# Altium schematic sheet Ethernet & LCD.SchDoc
size A4
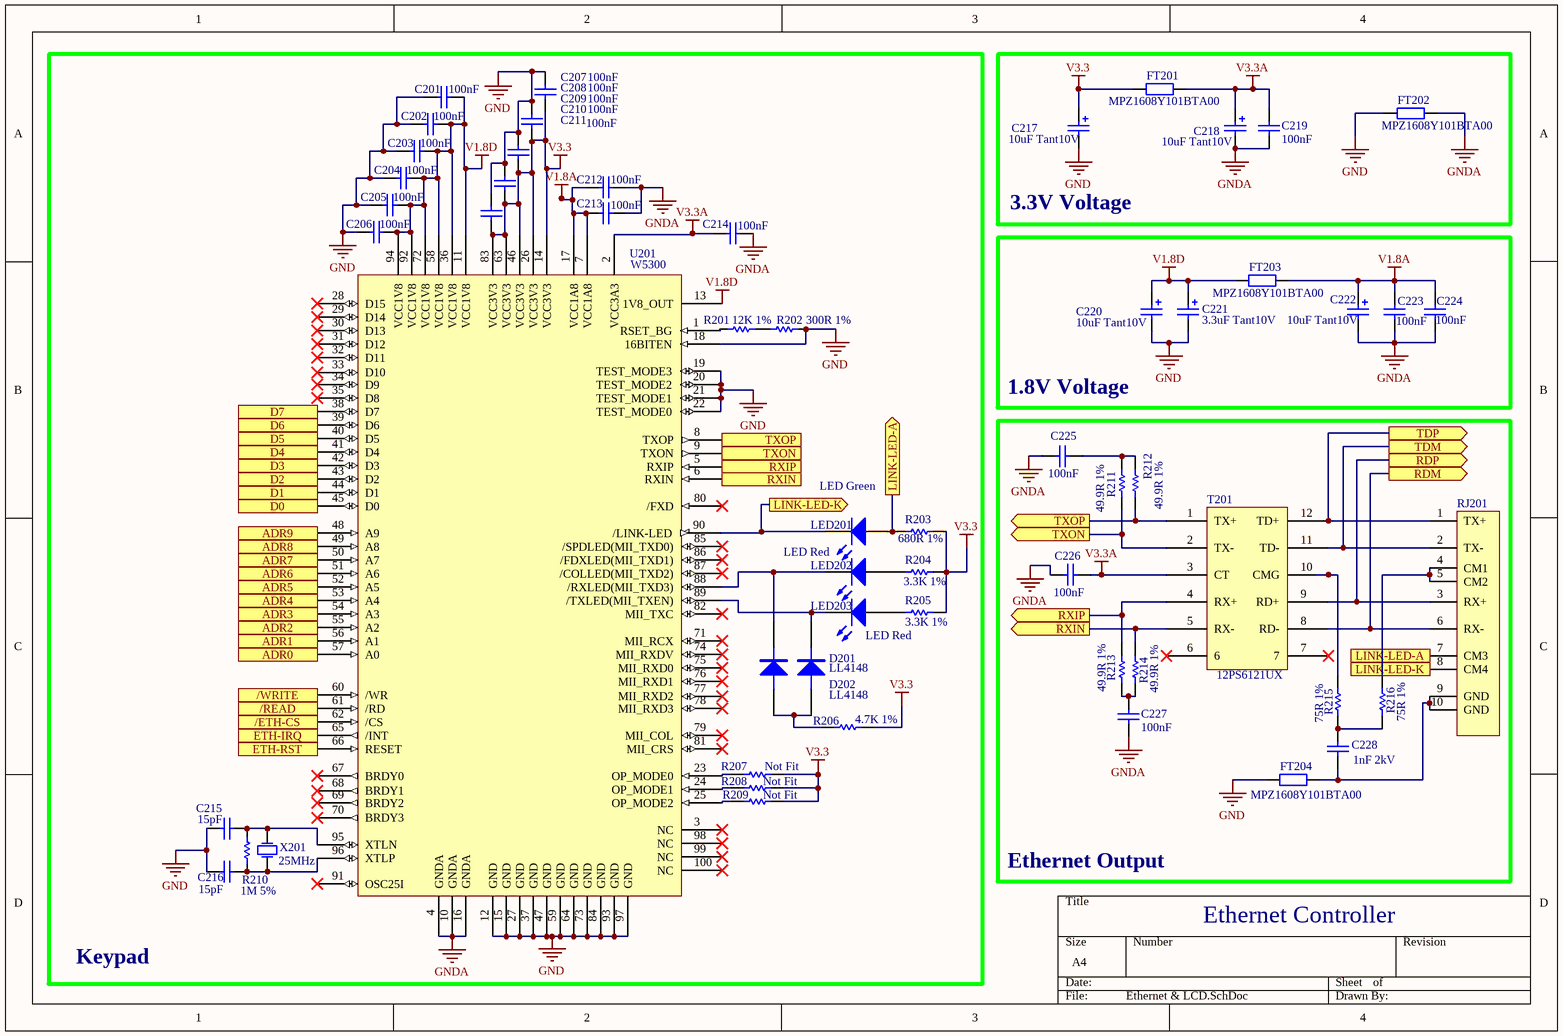
[diagram p0: Ethernet & LCD.SchDoc]

## Parts
C201  100nF  [1206_FA]
C202  100nF  [1206_FA]
C203  100nF  [1206_FA]
C204  100nF  [1206_FA]
C205  100nF  [1206_FA]
C206  100nF  [1206_FA]
C207  100nF  [1206_FA]
C208  100nF  [1206_FA]
C209  100nF  [1206_FA]
C210  100nF  [1206_FA]
C211  100nF  [1206_FA]
C212  100nF  [1206_FA]
C213  100nF  [1206_FA]
C214  100nF  [1206_FA]
C215  15pF  [1206_FA]
C216  15pF  [1206_FA]
C217  10uF Tant10V  [A]
C218  10uF Tant10V  [A]
C219  100nF  [1206_FA]
C220  10uF Tant10V  [A]
C221  3.3uF Tant10V  [A]
C222  10uF Tant10V  [A]
C223  100nF  [1206_FA]
C224  100nF  [1206_FA]
C225  100nF  [1206_FA]
C226  100nF  [1206_FA]
C227  100nF  [1206_FA]
C228  1nF 2kV  [1206_FA]
D201  LL4148  [MiniMelf]
D202  LL4148  [MiniMelf]
FT201  MPZ1608Y101BTA00  [0603]
FT202  MPZ1608Y101BTA00  [0603]
FT203  MPZ1608Y101BTA00  [0603]
FT204  MPZ1608Y101BTA00  [0603]
LED201  LED Green  [LEDSMD_1206]
LED202  LED Red  [LEDSMD_1206]
LED203  LED Red  [LEDSMD_1206]
R201  12K 1%  [1206_FA]
R202  300R 1%  [1206_FA]
R203  680R 1%  [1206_FA]
R204  3.3K 1%  [1206_FA]
R205  3.3K 1%  [1206_FA]
R206  4.7K 1%  [1206_FA]
R207  Not Fit  [1206_FA]
R208  Not Fit  [1206_FA]
R209  Not Fit  [1206_FA]
R210  1M 5%  [1206_FA]
R211  49.9R 1%  [1206_FA]
R212  49.9R 1%  [1206_FA]
R213  49.9R 1%  [1206_FA]
R214  49.9R 1%  [1206_FA]
R215  75R 1%  [1206_FA]
R216  75R 1%  [1206_FA]
RJ201  (no value)  [RJ45b]
T201  12PS6121UX  [12PS6121UX-DATA]
U201  W5300  [100T1_N]
X201  25MHz  [CRYSTAL 25.000MHZ]

## Blocks framed on the sheet
Keypad: C201-C216 D201 D202 LED201-LED203 R201-R210 U201 X201
3.3V Voltage: C217-C219 FT201 FT202
1.8V Voltage: C220-C224 FT203
Ethernet Output: C225-C228 FT204 R211-R216 RJ201 T201

## Ports
/ETH-CS (out), /READ (out), /WRITE (out), ADR0 (out), ADR1 (out), ADR2 (out), ADR3 (out), ADR4 (out), ADR5 (out), ADR6 (out), ADR7 (out), ADR8 (out), ADR9 (out), D0 (out), D1 (out), D2 (out), D3 (out), D4 (out), D5 (out), D6 (out), D7 (out), ETH-IRQ (out), ETH-RST (out), LINK-LED-A (out), LINK-LED-K (out), RDM (out), RDP (out), RXIN (out), RXIP (out), TDM (out), TDP (out), TXON (out), TXOP (out)

## Nets
GND: C201.2 C202.2 C203.2 C204.2 C205.2 C206.2 C207.1 C208.1 C209.1 C210.1 C211.1 C215.2 C216.2 C217.2 C220.2 C221.2 FT202.1 FT204.1 R202.2 U201.12(GND) U201.15(GND) U201.18(16BITEN) U201.19(TEST_MODE3) U201.20(TEST_MODE2) U201.21(TEST_MODE1) U201.22(TEST_MODE0) U201.27(GND) U201.37(GND) U201.47(GND) U201.59(GND) U201.64(GND) U201.73(GND) U201.84(GND) U201.93(GND) U201.97(GND)
GNDA: C212.1 C213.1 C214.1 C218.2 C219.1 C222.2 C223.1 C224.1 C225.1 C226.1 C227.1 FT202.2 U201.4(GNDA) U201.10(GNDA) U201.16(GNDA)
V1.8A: C212.2 C213.2 C222.1 C223.2 C224.2 FT203.2 U201.7(VCC1A8) U201.17(VCC1A8)
V1.8D: C201.1 C202.1 C203.1 C204.1 C205.1 C206.1 C220.1 C221.1 FT203.1 U201.11(VCC1V8) U201.13(1V8_OUT) U201.36(VCC1V8) U201.58(VCC1V8) U201.72(VCC1V8) U201.92(VCC1V8) U201.94(VCC1V8)
V3.3: C207.2 C208.2 C209.2 C210.2 C211.2 C217.1 FT201.1 R203.2 R204.2 R205.2 R206.2 R207.2 R208.2 R209.2 U201.14(VCC3V3) U201.26(VCC3V3) U201.46(VCC3V3) U201.63(VCC3V3) U201.83(VCC3V3)
V3.3A: C214.2 C218.1 C219.2 C226.2 FT201.2 T201.3(CT) U201.2(VCC3A3)
/ETH-CS: U201.62(/CS) ; port /ETH-CS
/READ: U201.61(/RD) ; port /READ
/WRITE: U201.60(/WR) ; port /WRITE
ADR0: U201.57(A0) ; port ADR0
ADR1: U201.56(A1) ; port ADR1
ADR2: U201.55(A2) ; port ADR2
ADR3: U201.54(A3) ; port ADR3
ADR4: U201.53(A4) ; port ADR4
ADR5: U201.52(A5) ; port ADR5
ADR6: U201.51(A6) ; port ADR6
ADR7: U201.50(A7) ; port ADR7
ADR8: U201.49(A8) ; port ADR8
ADR9: U201.48(A9) ; port ADR9
D0: U201.45(D0) ; port D0
D1: U201.44(D1) ; port D1
D2: U201.43(D2) ; port D2
D3: U201.42(D3) ; port D3
D4: U201.41(D4) ; port D4
D5: U201.40(D5) ; port D5
D6: U201.39(D6) ; port D6
D7: U201.38(D7) ; port D7
ETH-IRQ: U201.65(/INT) ; port ETH-IRQ
ETH-RST: U201.66(RESET) ; port ETH-RST
LINK-LED-A: LED201.1(A) R203.1 RJ201.7(CM3) ; port LINK-LED-A
LINK-LED-K: LED201.2(K) RJ201.8(CM4) U201.90(/LINK-LED) ; port LINK-LED-K
RDM: RJ201.6(RX-) T201.8(RD-) ; port RDM
RDP: RJ201.3(RX+) T201.9(RD+) ; port RDP
RXIN: R214.2 T201.5(RX-) U201.6(RXIN) ; port RXIN
RXIP: R213.2 T201.4(RX+) U201.5(RXIP) ; port RXIP
TDM: RJ201.2(TX-) T201.11(TD-) ; port TDM
TDP: RJ201.1(TX+) T201.12(TD+) ; port TDP
TXON: R211.1 T201.2(TX-) U201.9(TXON) ; port TXON
TXOP: R212.1 T201.1(TX+) U201.8(TXOP) ; port TXOP
NetC215_1: C215.1 R210.1 U201.95(XTLN) X201.1(OSC1)
NetC216_1: C216.1 R210.2 U201.96(XTLP) X201.2(OSC2)
NetC225_2: C225.2 R211.2 R212.2
NetC227_2: C227.2 R213.1 R214.1
NetC228_1: C228.1 FT204.2 RJ201.9(GND) RJ201.10(GND)
NetC228_2: C228.2 R215.1 R216.1
NetD201_1: D201.1(A) D202.1(A) R206.1
NetD201_2: D201.2(K) LED203.2(K) U201.89(/TXLED(MII_TXEN))
NetD202_2: D202.2(K) LED202.2(K) U201.88(/RXLED(MII_TXD3))
NetLED202_1: LED202.1(A) R204.1
NetLED203_1: LED203.1(A) R205.1
NetR201_1: R201.1 U201.1(RSET_BG)
NetR201_2: R201.2 R202.1
NetR207_1: R207.1 U201.23(OP_MODE0)
NetR208_1: R208.1 U201.24(OP_MODE1)
NetR209_1: R209.1 U201.25(OP_MODE2)
NetR215_2: R215.2 T201.10(CMG)
NetR216_2: R216.2 RJ201.4(CM1) RJ201.5(CM2)

Not connected (* = marked no-connect by the designer): T201 6* 7*; U201 3(NC)* 28(D15)* 29(D14)* 30(D13)* 31(D12)* 32(D11)* 33(D10)* 34(D9)* 35(D8)* 67(BRDY0)* 68(BRDY1)* 69(BRDY2)* 70(BRDY3)* 71(MII_RCX)* 74(MII_RXDV)* 75(MII_RXD0)* 76(MII_RXD1)* 77(MII_RXD2)* 78(MII_RXD3)* 79(MII_COL)* 80(/FXD)* 81(MII_CRS)* 82(MII_TXC)* 85(/SPDLED(MII_TXD0))* 86(/FDXLED(MII_TXD1))* 87(/COLLED(MII_TXD2))* 91(OSC25I)* 98(NC)* 99(NC)* 100(NC)*

## Notes on the sheet
- Ethernet Controller

## Library data of the parts
C201-C216 C219 C223-C227 = Cap Semi: Capacitor (Semiconductor SIM Model); Value: 100pF; Published: 8-Jun-2000; LatestRevisionDate: 17-Jul-2002; LatestRevisionNote: Re-released for DXP Platform.; PackageReference: C1206; Publisher: Altium Limited
C217 C218 C220-C222 = Cap Pol3: Polarized Capacitor (Surface Mount); Value: 100pF; Published: 8-Jun-2000; LatestRevisionDate: 17-Jul-2002; LatestRevisionNote: Re-released for DXP Platform.; PackageReference: C0805; Publisher: Altium Limited
C228 = Cap: Capacitor; Value: 100pF; Published: 8-Jun-2000; LatestRevisionDate: 17-Jul-2002; LatestRevisionNote: Re-released for DXP Platform.; PackageReference: RAD-0.3; Publisher: Altium Limited
D201 D202 = DIODE
FT201-FT204 = Res2: Resistor; Value: 1K; Published: 8-Jun-2000; LatestRevisionDate: 17-Jul-2002; LatestRevisionNote: Re-released for DXP Platform.; PackageReference: AXIAL-0.4; Publisher: Altium Limited
LED201-LED203 = LED2: Typical RED, GREEN, YELLOW, AMBER GaAs LED; Published: 8-Jun-2000; LatestRevisionDate: 17-Jul-2002; LatestRevisionNote: Re-released for DXP Platform.; PackageDocument: Feb-2002; PackageReference: 3.2X1.6X1.1; Publisher: Altium Limited
R201-R216 = Res Semi: Semiconductor Resistor; Value: 1K; Published: 8-Jun-2000; LatestRevisionDate: 17-Jul-2002; LatestRevisionNote: Re-released for DXP Platform.; PackageReference: AXIAL-0.5; Publisher: Altium Limited
RJ201 = rj45
T201 = Component_1
U201 = ATMEGA163_DIP40: Atmel Microcontroller - Library created by carel..  <www.mpfreezone.com>
X201 = XTAL: Crystal Oscillator; Published: 8-Jun-2000; LatestRevisionDate: 17-Jul-2002; LatestRevisionNote: Re-released for DXP Platform.; PackageReference: R38; Publisher: Altium Limited